# Altium schematic sheet Communication.SchDoc
size A4
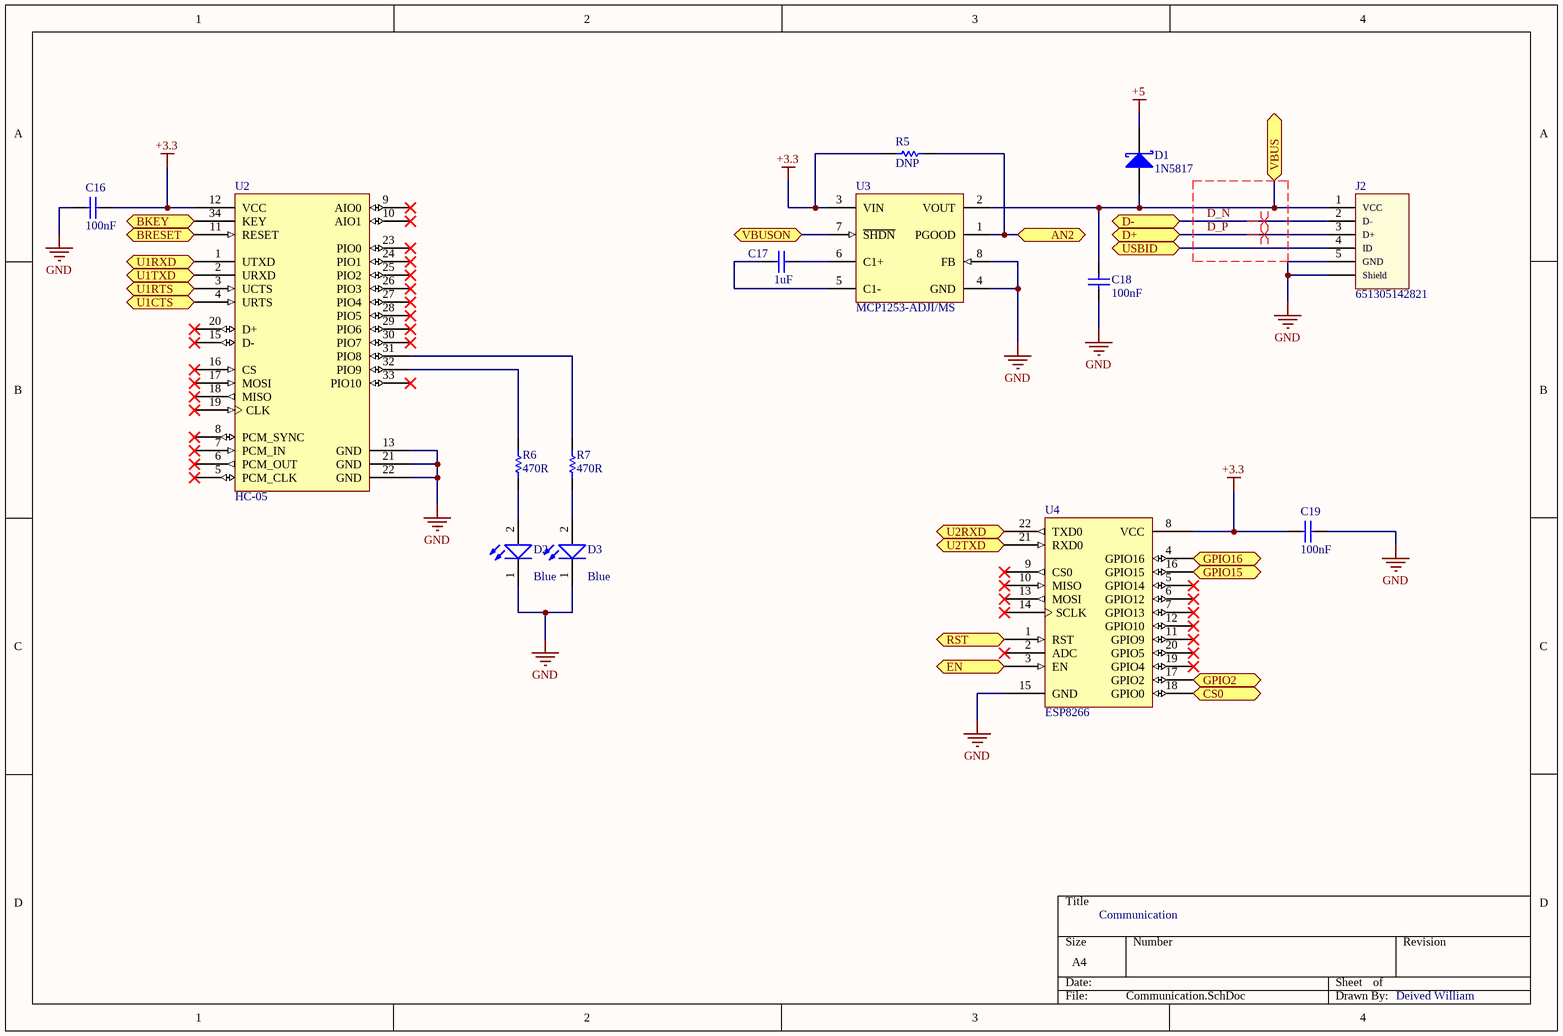
[diagram p0: Communication.SchDoc]

## Parts
C16  value 100nF  [WCAP-CSGP_0603, 1.6x0.8x0.8mm_Reflow]  (hidden comment: 885012206020)
C17  value 1uF  [WCAP-CSGP_0603, 1.6x0.8x0.8mm_Reflow]  (hidden comment: 885012106022)
C18  value 100nF  [WCAP-CSGP_0603, 1.6x0.8x0.8mm_Reflow]  (hidden comment: 885012206020)
C19  value 100nF  [WCAP-CSGP_0603, 1.6x0.8x0.8mm_Reflow]  (hidden comment: 885012206020)
D1  1N5817  [MELFDIODE]
D2  Emitting Color: Blue  [WL-SMCW_0805]  (hidden comment: 150080BS75000)
D3  Emitting Color: Blue  [WL-SMCW_0805]  (hidden comment: 150080BS75000)
J2  651305142821  [651305142821]
R5  DNP  [3-0603]
R6  470R  [3-0603]
R7  470R  [3-0603]
U2  HC-05  [LCC42]
U3  MCP1253-ADJI/MS  [MSOP-MS8_N]
U4  ESP8266  [LCC28]

## Ports
AN2, BKEY, BRESET, CS0, D+, D-, EN, GPIO2, GPIO15, GPIO16, RST, U1CTS, U1RTS, U1RXD, U1TXD, U2RXD, U2TXD, USBID, VBUS, VBUSON

## Nets
+3.3: C16.2 C19.1 R5.1 U2.12(VCC) U3.3(VIN) U4.8(VCC)
+5: D1.2(K)
GND: C16.1 C18.1 C19.2 D2.1(K) D3.1(K) J2.5(GND) J2.Shell(Shield) U2.13(GND) U2.21(GND) U2.22(GND) U3.4(GND) U3.8(FB) U4.15(GND)
AN2: R5.2 U3.1(PGOOD) ; port AN2
BKEY: U2.34(KEY) ; port BKEY
BRESET: U2.11(RESET) ; port BRESET
CS0: U4.18(GPIO0) ; port CS0
D_N: J2.2(D-) ; port D-
D_P: J2.3(D+) ; port D+
EN: U4.3(EN) ; port EN
GPIO2: U4.17(GPIO2) ; port GPIO2
GPIO15: U4.16(GPIO15) ; port GPIO15
GPIO16: U4.4(GPIO16) ; port GPIO16
RST: U4.1(RST) ; port RST
U1CTS: U2.4(URTS) ; port U1CTS
U1RTS: U2.3(UCTS) ; port U1RTS
U1RXD: U2.1(UTXD) ; port U1RXD
U1TXD: U2.2(URXD) ; port U1TXD
U2RXD: U4.22(TXD0) ; port U2RXD
U2TXD: U4.21(RXD0) ; port U2TXD
USBID: J2.4(ID) ; port USBID
VBUS: C18.2 D1.1(A) J2.1(VCC) U3.2(VOUT) ; port VBUS
VBUSON: U3.7(~{SHDN}) ; port VBUSON
NetC17_1: C17.1 U3.6(C1+)
NetC17_2: C17.2 U3.5(C1-)
NetD2_2: D2.2(A) R6.1
NetD3_2: D3.2(A) R7.1
NetR6_2: R6.2 U2.32(PIO9)
NetR7_2: R7.2 U2.31(PIO8)

Not connected (* = marked no-connect by the designer): U2 5(PCM_CLK)* 6(PCM_OUT)* 7(PCM_IN)* 8(PCM_SYNC)* 9(AIO0)* 10(AIO1)* 15(D-)* 16(CS)* 17(MOSI)* 18(MISO)* 19(CLK)* 20(D+)* 23(PIO0)* 24(PIO1)* 25(PIO2)* 26(PIO3)* 27(PIO4)* 28(PIO5)* 29(PIO6)* 30(PIO7)* 33(PIO10)*; U4 2(ADC)* 5(GPIO14)* 6(GPIO12)* 7(GPIO13)* 9(CS0)* 10(MISO)* 11(GPIO9)* 12(GPIO10)* 13(MOSI)* 14(SCLK)* 19(GPIO4)* 20(GPIO5)*

## Layout directives
differential pair: D_N, D_P

## Notes on the sheet
- Communication
- Deived William

## Library data of the parts
C16 C18 C19 = 885012206020: WCAP-CSGP Ceramic Capacitors, size 0603, 1.6x0.8x0.8mm, 10V, X7R, 100nF; Rated Voltage: 10V DC; ComponentLink1Description: Manufacturer; ComponentLink1URL: http://www.we-online.de; ComponentLink2Description: Datasheet; ComponentLink2URL: http://katalog.we-online.de/pbs/datasheet/885012206020.pdf; Part Number: 885012206020; Published Date: June 2017; Publisher: Wurth Elektronik; Size: 0603, 1.6x0.8x0.8mm; Ceramic Type: X7R
C17 = 885012106022: WCAP-CSGP Ceramic Capacitors, size 0603, 1.6x0.8x0.8mm, 25V, X5R, 1uF; Rated Voltage: 25V DC; ComponentLink1Description: Manufacturer; ComponentLink1URL: http://www.we-online.de; ComponentLink2Description: Datasheet; ComponentLink2URL: http://katalog.we-online.de/pbs/datasheet/885012106022.pdf; Part Number: 885012106022; Published Date: June 2017; Publisher: Wurth Elektronik; Size: 0603, 1.6x0.8x0.8mm; Ceramic Type: X5R
D1 = 1N5817: Schottky diode Barrier Rectifier
D2 D3 = 150080BS75000: WL-SMCW SMD Mono-color Chip LED Waterclear, size 0805, Blue; Forward Voltage: 3.2 V; Viewing Angle: 140°; Peak Wavelength: 465 nm; Published Date: Jan 2017; Publisher: Wurth Elektronik; ComponentLink1Description: Manufacturer; ComponentLink1URL: http://www.we-online.de; ComponentLink2Description: Datasheet; ComponentLink2URL: http://katalog.we-online.de/led/datasheet/150080BS75000.pdf; Part Number: 150080BS75000; Size: 0805
J2 = 651305142821: Mini USB 2.0 Type AB SMT Horizontal 5 Contacts WR-COM; Interface Type: Type AB; Gender: Receptacle; ComponentLink1Description: Manufacturer; ComponentLink1URL: http://www.we-online.de; ComponentLink2Description: Datasheet; ComponentLink2URL: http://katalog.we-online.de/em/datasheet/651305142821.pdf; Part Number: 651305142821; Published Date: April 2017; Publisher: Wurth Elektronik; Sub-Family: Mini USB 2.0; Type: Horizontal; Construction: SMT
R5 = ERJ3RB: Precision Thick Film Chip Resistor, 10 Ohm to 1M Ohm Range, 1% and 0.5% Tolerance, 0603 Size, 0.063 W; Published: 17-Dec-2003; LatestRevisionDate: 19-Mar-2004; LatestRevisionNote: Silkscreen size reduced.; PackageDocument: Mar-2003; PackageReference: 3-0603; Publisher: Altium Limited; Code_IPC: 1608 [0603]; ComponentLink1Description: Manufacturer Link; ComponentLink1URL: http://www.panasonic.com/industrial/components/resistive_products.htm; ComponentLink2Description: Datasheet; ComponentLink2URL: http://www.panasonic.com/industrial/components/pdf/AOA0000CE2.pdf
R6 R7 = ERJ3RE: Precision Thick Film Chip Resistor, 10 Ohm to 1M Ohm Range, 1% and 0.5% Tolerance, 0603 Size, 0.063 W; Published: 17-Dec-2003; LatestRevisionDate: 19-Mar-2004; LatestRevisionNote: Silkscreen size reduced.; PackageDocument: Mar-2003; PackageReference: 3-0603; Publisher: Altium Limited; Code_IPC: 1608 [0603]; ComponentLink1Description: Manufacturer Link; ComponentLink1URL: http://www.panasonic.com/industrial/components/resistive_products.htm; ComponentLink2Description: Datasheet; ComponentLink2URL: http://www.panasonic.com/industrial/components/pdf/AOA0000CE2.pdf
U2 = Bluetooth HC-05: Modulo Bluetooth HC-05
U3 = MCP1253-ADJI/MS: Low Noise, Positive-Regulated Charge Pump, 1MHz, Adjustable Output, 8-Pin MSOP, Industrial Temperature; Published: 29-Jan-2009; DatasheetVersion: revA, Nov-2002; PackageVersion: revBB, Aug-2009; PackageReference: MSOP-MS8; Publisher: Altium Limited; PackageDescription: 8-Lead Plastic Micro Small Outline Package (MS) [MSOP]; Supplier 1: Digi-Key; Supplier Part Number 1: MCP1253-ADJI/MS-ND; Supplier 2: Farnell; Supplier Part Number 2: 1332068; ComponentLink1Description: Datasheet; ComponentLink1URL: http://ww1.microchip.com/downloads/en/DeviceDoc/21752a.pdf; ComponentLink2Description: Packaging Specification; ComponentLink2URL: http://www.microchip.com/stellent/groups/techpub_sg/documents/packagingspec/en012702.pdf; ComponentLink3Description: Microchip.com Home; ComponentLink3URL: http://www.microchip.com/
U4 = ESP8266: Modulo WIFI ESP8266